# Altium project TS_24 UCM R2.PrjPcb
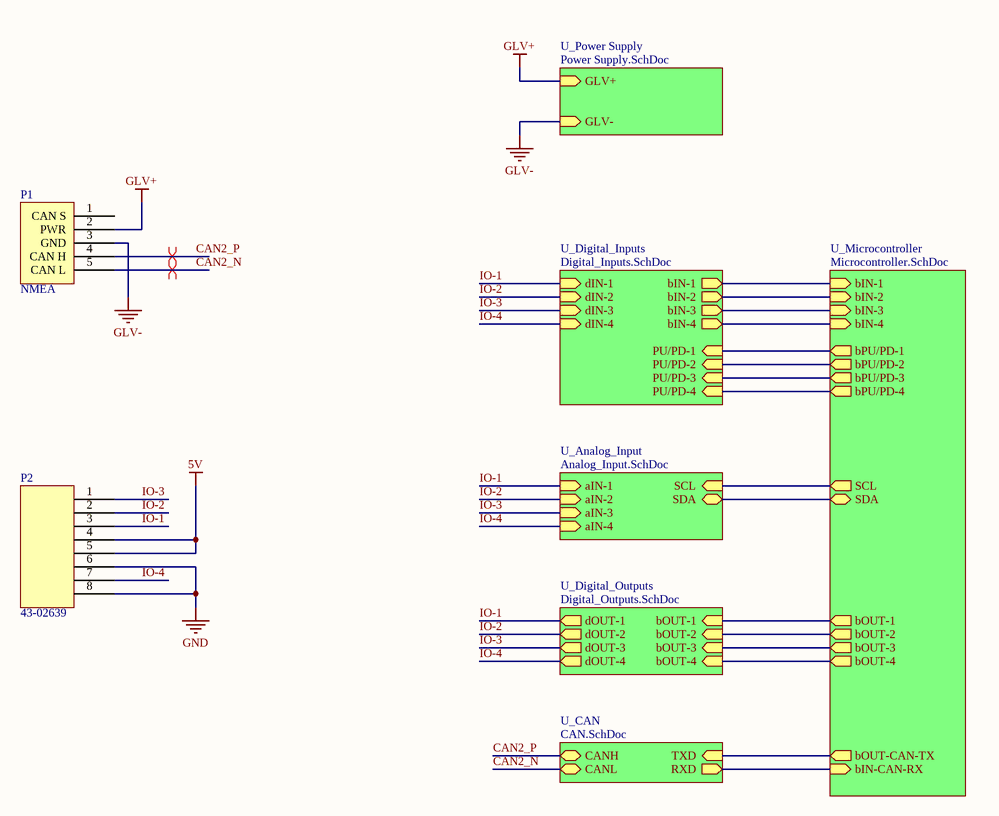
[diagram p0: Top Level.SchDoc]
3 sheets, 18 parts. Net scope: hierarchical (ports join the sheet entries above them; power ports are global).
Board file: TS_24 UCM R1.PcbDoc
Sheets:
  Top Level.SchDoc
    U_Analog_Input = Analog_Input.SchDoc
    U_Digital_Outputs = Digital_Outputs.SchDoc

## Sheet Top Level.SchDoc
size A4

### Parts
P1  NMEA  [43-01203]
P2  43-02639  [43-02639]

### Sub-sheets
U_Analog_Input = Analog_Input.SchDoc: SCL (in), SDA (bidir), aIN-1 (in), aIN-2 (in), aIN-3 (in), aIN-4 (in)
U_CAN = CAN.SchDoc (file not in this document): TXD (in), RXD (out), CANH (bidir), CANL (bidir)
U_Digital_Inputs = Digital_Inputs.SchDoc (file not in this document): dIN-1 (in), dIN-2 (in), dIN-3 (in), dIN-4 (in), bIN-4 (out), bIN-2 (out), bIN-1 (out), bIN-3 (out), PU/PD-1 (in), PU/PD-2 (in), PU/PD-3 (in), PU/PD-4 (in)
U_Digital_Outputs = Digital_Outputs.SchDoc: bOUT-1 (in), bOUT-2 (in), bOUT-3 (in), bOUT-4 (in), dOUT-1 (out), dOUT-2 (out), dOUT-3 (out), dOUT-4 (out)
U_Microcontroller = Microcontroller.SchDoc (file not in this document): bOUT-CAN-TX (out), bIN-CAN-RX (in), SCL (out), SDA (bidir), bOUT-1 (out), bOUT-2 (out), bOUT-3 (out), bOUT-4 (out), bIN-1 (in), bIN-2 (in), bIN-3 (in), bIN-4 (in), bPU/PD-1 (out), bPU/PD-2 (out), bPU/PD-3 (out), bPU/PD-4 (out)
U_Power Supply = Power Supply.SchDoc (file not in this document): GLV+ (in), GLV- (in)

### Nets
5V: P2.4 P2.5
GLV+: P1.2(PWR) ; sheet U_Power Supply/GLV+
GLV-: P1.3(GND) ; sheet U_Power Supply/GLV-
GND: P2.6 P2.8
CAN2_N: P1.5(CAN_L) ; sheet U_CAN/CANL
CAN2_P: P1.4(CAN_H) ; sheet U_CAN/CANH
IO-1: P2.3 ; sheet U_Analog_Input/aIN-1, sheet U_Digital_Outputs/dOUT-1, sheet U_Digital_Inputs/dIN-1
IO-2: P2.2 ; sheet U_Analog_Input/aIN-2, sheet U_Digital_Outputs/dOUT-2, sheet U_Digital_Inputs/dIN-2
IO-3: P2.1 ; sheet U_Analog_Input/aIN-3, sheet U_Digital_Outputs/dOUT-3, sheet U_Digital_Inputs/dIN-3
IO-4: P2.7 ; sheet U_Analog_Input/aIN-4, sheet U_Digital_Outputs/dOUT-4, sheet U_Digital_Inputs/dIN-4
NetR9_2: sheet U_Digital_Outputs/bOUT-2, sheet U_Microcontroller/bOUT-2
NetR10_2: sheet U_Digital_Outputs/bOUT-3, sheet U_Microcontroller/bOUT-3
NetR26_2: sheet U_Digital_Outputs/bOUT-4, sheet U_Microcontroller/bOUT-4
NetR27_2: sheet U_Digital_Outputs/bOUT-1, sheet U_Microcontroller/bOUT-1
NetU1_13: sheet U_Analog_Input/SDA, sheet U_Microcontroller/SDA
NetU1_14: sheet U_Analog_Input/SCL, sheet U_Microcontroller/SCL
(unnamed): sheet U_CAN/TXD, sheet U_Microcontroller/bOUT-CAN-TX
(unnamed): sheet U_CAN/RXD, sheet U_Microcontroller/bIN-CAN-RX
(unnamed): sheet U_Microcontroller/bIN-1, sheet U_Digital_Inputs/bIN-1
(unnamed): sheet U_Microcontroller/bIN-2, sheet U_Digital_Inputs/bIN-2
(unnamed): sheet U_Microcontroller/bIN-3, sheet U_Digital_Inputs/bIN-3
(unnamed): sheet U_Microcontroller/bIN-4, sheet U_Digital_Inputs/bIN-4
(unnamed): sheet U_Microcontroller/bPU/PD-1, sheet U_Digital_Inputs/PU/PD-1
(unnamed): sheet U_Microcontroller/bPU/PD-2, sheet U_Digital_Inputs/PU/PD-2
(unnamed): sheet U_Microcontroller/bPU/PD-3, sheet U_Digital_Inputs/PU/PD-3
(unnamed): sheet U_Microcontroller/bPU/PD-4, sheet U_Digital_Inputs/PU/PD-4

Not connected (* = marked no-connect by the designer): P1 1(CAN_S)

### Layout directives
differential pair: CAN2_N, CAN2_P

### Library data of the parts
P1 = 43-01203: M12 NMEA 2000 Header; Positions: 5; Angle: 90; Flange: Yes; Contact: Gold; Part Number: 43-01203; Digikey Part Number: 626-1511-ND
P2 = 43-02639: M12, 8 Pin Connector; Positions: 8; Angle: 90; Flange: Yes; Contact: Copper Alloy; Part Number: 43-02639

## Sheet Analog_Input.SchDoc
size A4
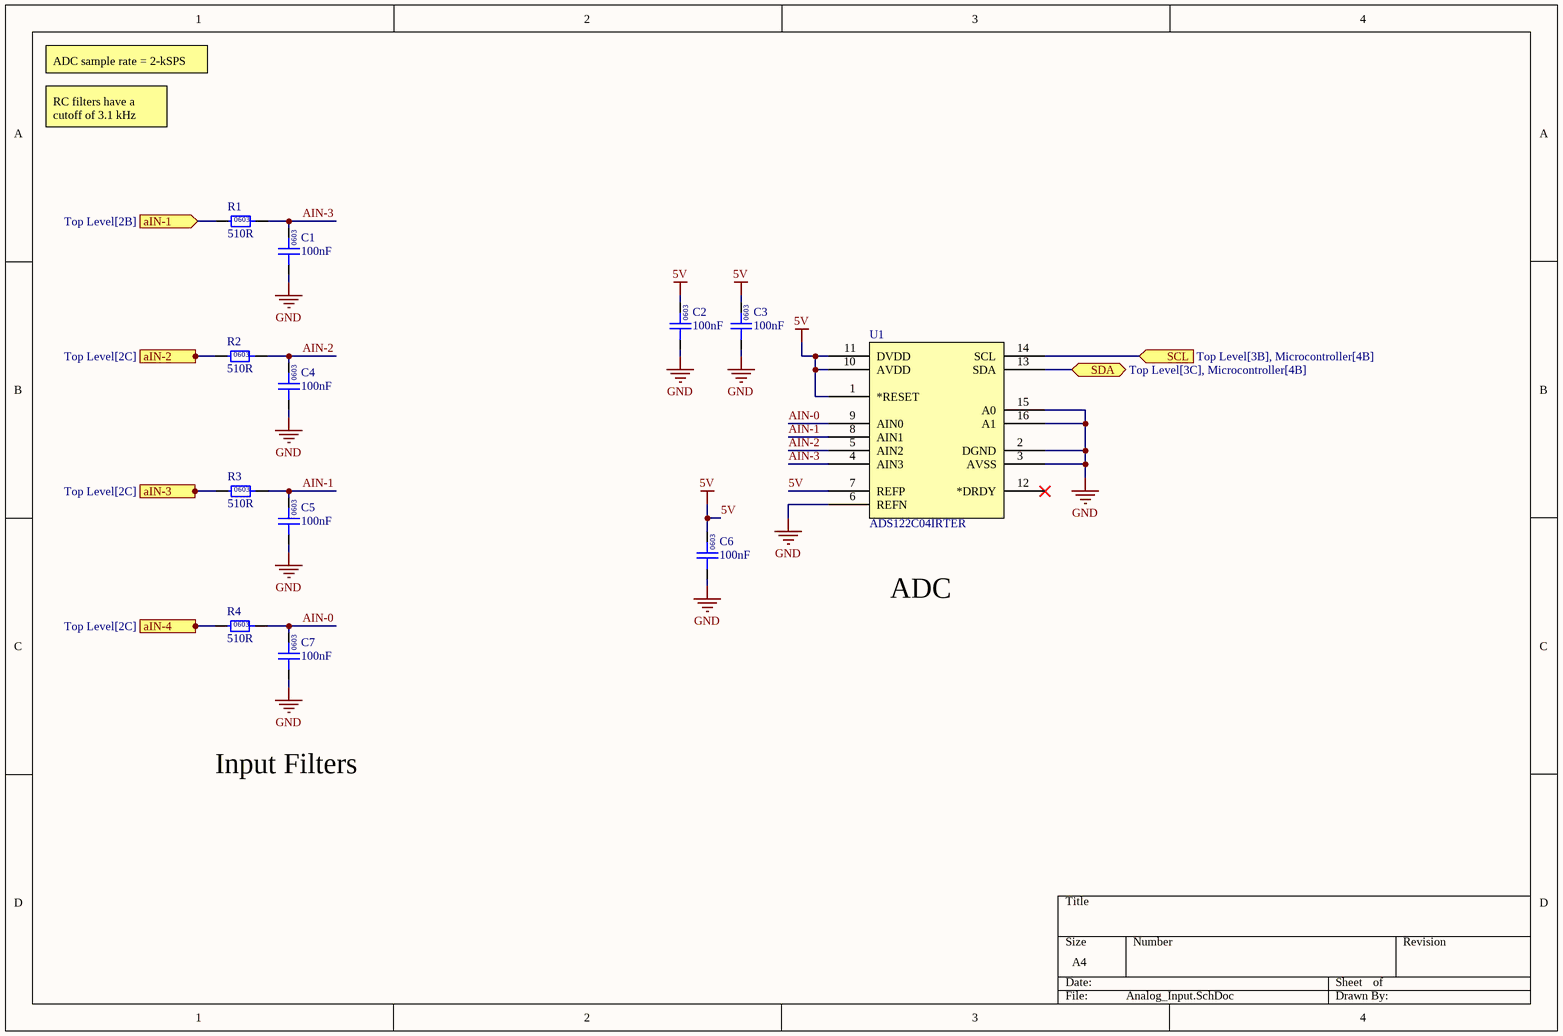
[diagram p1: Analog_Input.SchDoc]

### Parts
C1  100nF  [0603]
C2  100nF  [0603]
C3  100nF  [0603]
C4  100nF  [0603]
C5  100nF  [0603]
C6  100nF  [0603]
C7  100nF  [0603]
R1  510R  [0603]
R2  510R  [0603]
R3  510R  [0603]
R4  510R  [0603]
U1  ADS122C04IRTER  [TI 16-WQFN (3x3)]

### Ports
aIN-1 (in, see Top Level[2B]), aIN-2 (in, see Top Level[2C]), aIN-3 (in, see Top Level[2C]), aIN-4 (in, see Top Level[2C]), SCL (in, see Top Level[3B], Microcontroller[4B]), SDA (bidir, see Top Level[3C], Microcontroller[4B])

### Nets
5V: C2.2 C3.2 C6.2 U1.1(*RESET) U1.7(REFP) U1.10(AVDD) U1.11(DVDD)
GND: C1.1 C2.1 C3.1 C4.1 C5.1 C6.1 C7.1 U1.2(DGND) U1.3(AVSS) U1.6(REFN) U1.15(A0) U1.16(A1)
AIN-0: C7.2 R4.2 U1.9(AIN0)
AIN-1: C5.2 R3.2 U1.8(AIN1)
AIN-2: C4.2 R2.2 U1.5(AIN2)
AIN-3: C1.2 R1.2 U1.4(AIN3)
IO-1: R1.1 ; port aIN-1
IO-2: R2.1 ; port aIN-2
IO-3: R3.1 ; port aIN-3
IO-4: R4.1 ; port aIN-4
NetU1_13: U1.13(SDA) ; port SDA
NetU1_14: U1.14(SCL) ; port SCL

Not connected (* = marked no-connect by the designer): U1 12(*DRDY)*

### Notes on the sheet
- ADC sample rate = 2-kSPS
- RC filters have a cutoff of 3.1 kHz
- ADC
- Input Filters
- (in symbol GCM188L81H104KA57D) 0603
- (in symbol RC0603FR-07510RL) 0603

### Library data of the parts
C1-C7 = GCM188L81H104KA57D: Manufacturer: muRata; Rated Voltage: 50V; Tolerance: ±10%; Material: MLCC; Temperature Rating: X8L; Part Number: GCM188L81H104KA57D; Value: 100nF; Digikey Part Number: 490-6049-1-ND
R1-R4 = RC0603FR-07510RL: Manufacturer: YAGEO; Tolerance: 0.01; Rated Power: 0.1W; Part Number: RC0603FR-07510RL; Value: 510R; Material: FR-07; Digikey Part Number: 311-510HRCT-ND
U1 = ADS122C04IRTER: IC ADC 24BIT SIGMA-DELTA 16WQFN; Manufacturer: Texas Instruments; Complex IC: 1; Part Number: ADS122C04IRTER; Digikey Part Number: 296-50886-1-ND; Digikey Link: https://www.digikey.com.au/en/products/detail/texas-instruments/ADS122C04IRTER/9665929

## Sheet Digital_Outputs.SchDoc
size A4
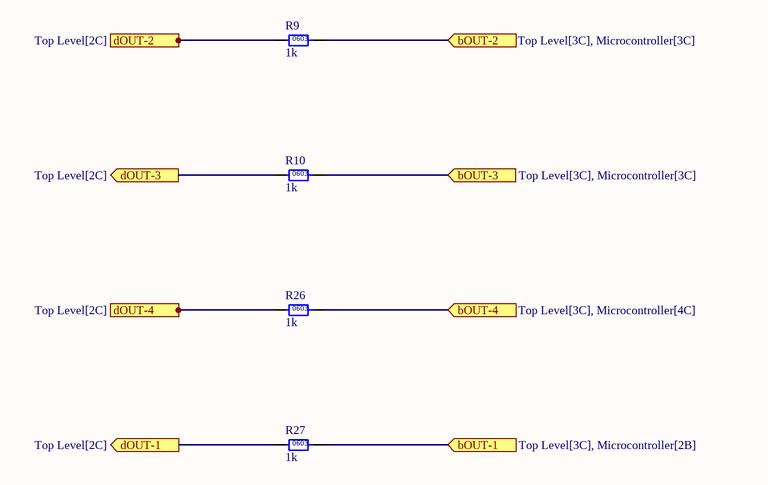
[diagram p2: Digital_Outputs.SchDoc]

### Parts
R9  1k  [0603]
R10  1k  [0603]
R26  1k  [0603]
R27  1k  [0603]

### Ports
bOUT-1 (in, see Top Level[3C], Microcontroller[2B]), bOUT-2 (in, see Top Level[3C], Microcontroller[3C]), bOUT-3 (in, see Top Level[3C], Microcontroller[3C]), bOUT-4 (in, see Top Level[3C], Microcontroller[4C]), dOUT-1 (out, see Top Level[2C]), dOUT-2 (out, see Top Level[2C]), dOUT-3 (out, see Top Level[2C]), dOUT-4 (out, see Top Level[2C])

### Nets
IO-1: R27.1 ; port dOUT-1
IO-2: R9.1 ; port dOUT-2
IO-3: R10.1 ; port dOUT-3
IO-4: R26.1 ; port dOUT-4
NetR9_2: R9.2 ; port bOUT-2
NetR10_2: R10.2 ; port bOUT-3
NetR26_2: R26.2 ; port bOUT-4
NetR27_2: R27.2 ; port bOUT-1

### Notes on the sheet
- (in symbol RC0603FR-071KL) 0603

### Library data of the parts
R9 R10 R26 R27 = RC0603FR-071KL: Manufacturer: YAGEO; Tolerance: 0.01; Rated Power: 0.1W; Part Number: RC0603FR-071KL; Value: 1k; Material: FR-07; Digikey Part Number: 311-1.00KHRCT-ND

## Nets that join several sheets
5V: Top Level (P2.4 P2.5), Analog_Input (7 pins)
GND: Top Level (P2.6 P2.8), Analog_Input (12 pins)
IO-1: Top Level (P2.3), Analog_Input (R1.1), Digital_Outputs (R27.1)
IO-2: Top Level (P2.2), Analog_Input (R2.1), Digital_Outputs (R9.1)
IO-3: Top Level (P2.1), Analog_Input (R3.1), Digital_Outputs (R10.1)
IO-4: Top Level (P2.7), Analog_Input (R4.1), Digital_Outputs (R26.1)